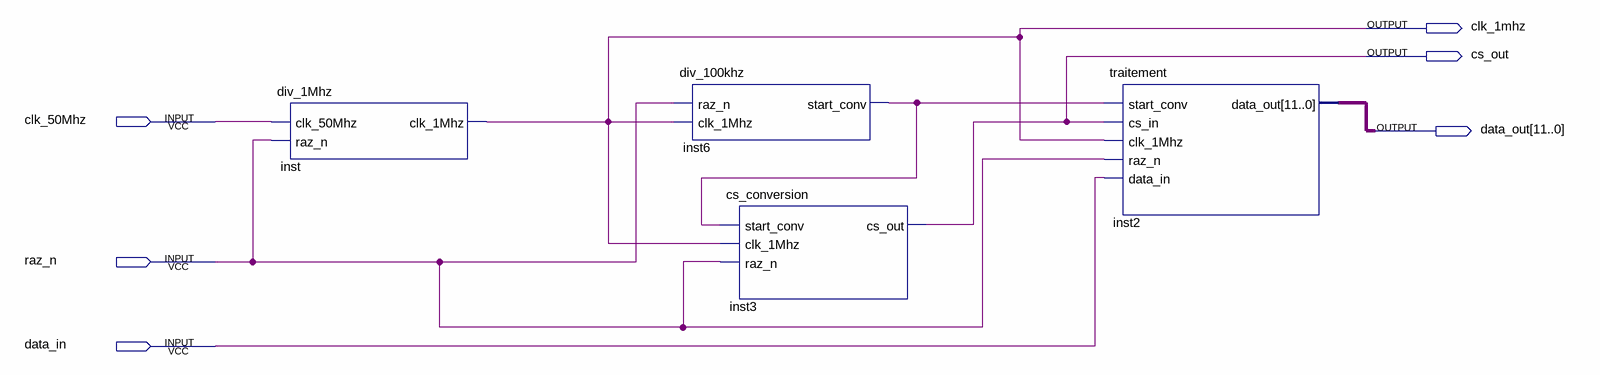
[diagram p0: schematic sheet]
// Quartus schematic fct_verin.bdf as structural Verilog: 4 symbols, 6 pins
module fct_verin (
  input  clk_50Mhz,
  input  raz_n,
  input  data_in,
  output clk_1mhz,
  output cs_out,
  output [11:0] data_out
);

  wire inst6_start_conv;

  div_1Mhz inst (.clk_50Mhz(clk_50Mhz), .raz_n(raz_n), .clk_1Mhz(clk_1mhz));
  div_100khz inst6 (.raz_n(raz_n), .clk_1Mhz(clk_1mhz), .start_conv(inst6_start_conv));
  cs_conversion inst3 (.start_conv(inst6_start_conv), .clk_1Mhz(clk_1mhz), .raz_n(raz_n), .cs_out(cs_out));
  traitement inst2 (
    .start_conv(inst6_start_conv), .cs_in(cs_out), .clk_1Mhz(clk_1mhz), .raz_n(raz_n), .data_in(data_in),
    .data_out(data_out));
endmodule
